# Altium schematic sheet Arduino.SchDoc: Processing interface
size A4; SheetNumber: 1; SheetTotal: 5; ENG_APP_DATE: --/--/--; DSN_APP_DATE: --/--/--; CHK_APP_DATE: --/--/--; SPICEModelCacheCJHNTGTK: <root> / <DocumentId>CJHNTGTK</DocumentId> / </root>
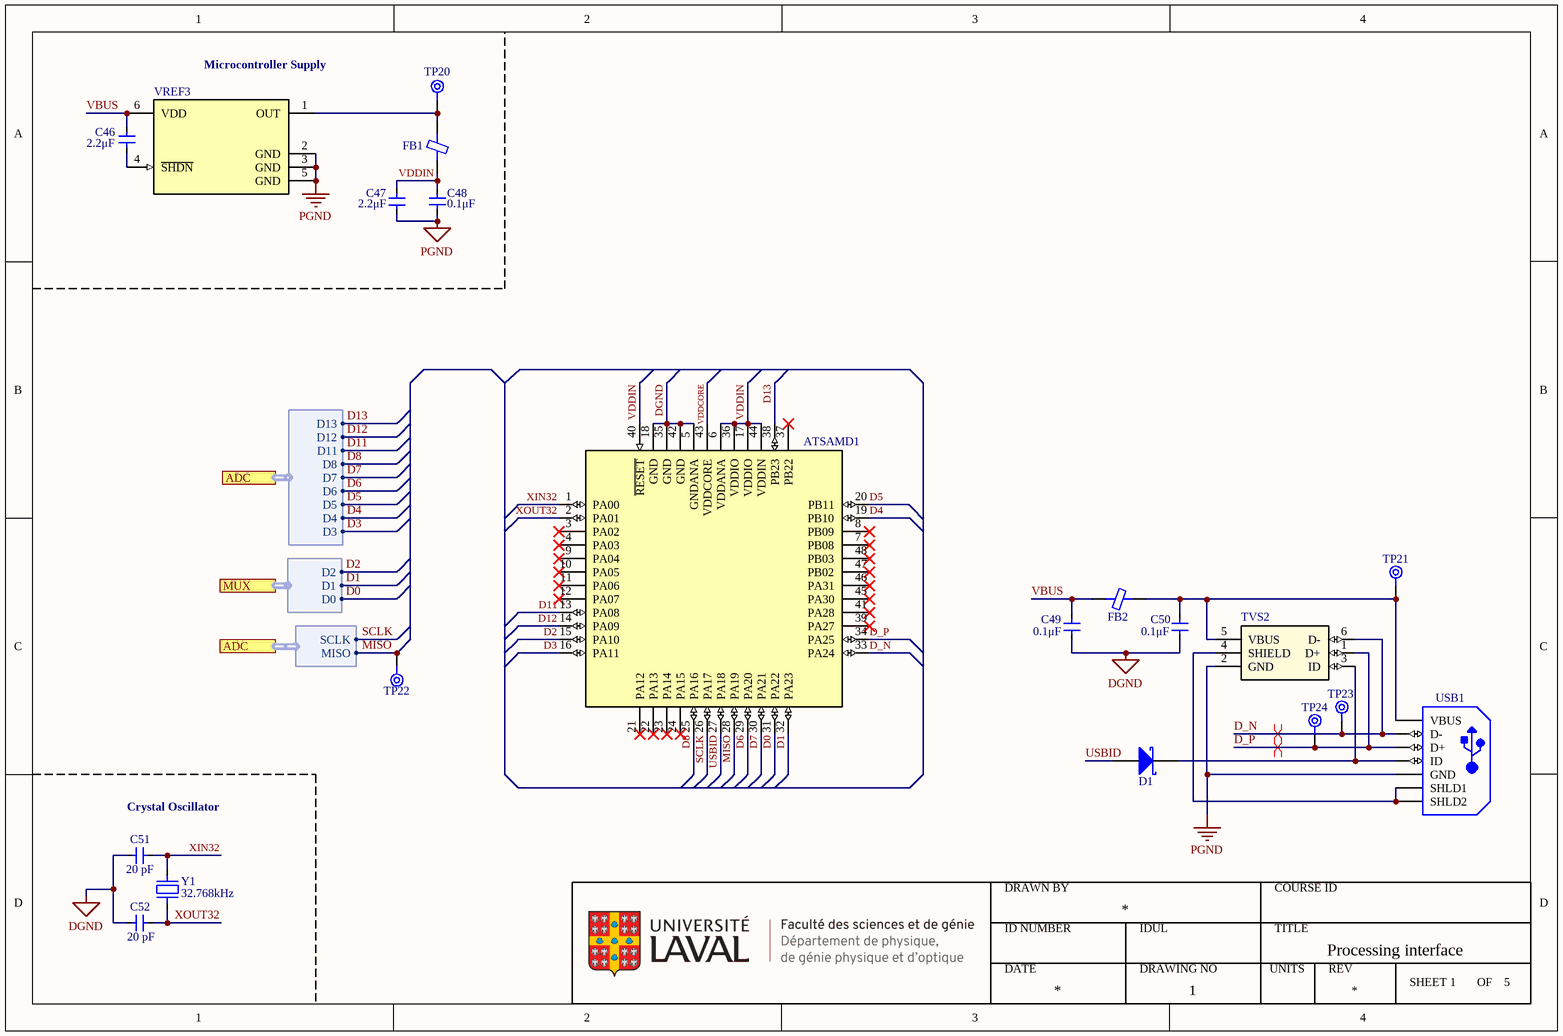
[diagram p0: Arduino.SchDoc]

## Parts
ATSAMD1  (no value)  [ATSAMD21G18-AU]
C46  value 2.2μF  [Cap Ceramic 2.2 uF 6.3V SMT 0603]  (hidden comment: Cap Ceramic 2.2 uF SMT 0603)
C47  value 2.2μF  [Cap Ceramic 2.2 uF 6.3V SMT 0603]  (hidden comment: CC0603KRX7R5BB225)
C48  Capacitance: 0.1μF  [Cap Ceramic 0.1 uF 50V SMT 0603]  (hidden comment: Cap Ceramic 0.1 uF SMT 0603)
C49  Capacitance: 0.1μF  [Cap Ceramic 0.1 uF 50V SMT 0603]  (hidden comment: Cap Ceramic 0.1 uF SMT 0603)
C50  Capacitance: 0.1μF  [Cap Ceramic 0.1 uF 50V SMT 0603]  (hidden comment: Cap Ceramic 0.1 uF SMT 0603)
C51  Capacitance: 20 pF  [Capacitor 20 pF SMT 0603]  (hidden comment: CC0603JRNPO9BN200)
C52  Capacitance: 20 pF  [Capacitor 20 pF SMT 0603]  (hidden comment: CC0603JRNPO9BN200)
D1  NSR0530HT1G  [Schottky Diode 30V SMT]  (value not drawn)
FB1  MFBM1V1608-000-R  [Eaton Ferrite Bead 0603]  (value not drawn)
FB2  MFBM1V1608-000-R  [Eaton Ferrite Bead 0603]  (value not drawn)
TP20  Test Point  [SQ Pad]  (value not drawn)  (no BOM)
TP21  Test Point  [SQ Pad]  (value not drawn)  (no BOM)
TP22  Test Point  [SQ Pad]  (value not drawn)  (no BOM)
TP23  Test Point  [SQ Pad]  (value not drawn)  (no BOM)
TP24  Test Point  [SQ Pad]  (value not drawn)  (no BOM)
TVS2  USB OTG TVS Diode Array 25V Clamp SMD  [RCLAMP0504FA.TCT]  (value not drawn)
USB1  USB3106-30-0230-A  [USB Micro-AB Connector B]  (value not drawn)
VREF3  Voltage Reference Series Fixed 3.3V  [MCP1501T-XXE/CHY]  (value not drawn)
Y1  value 32.768kHz  [ABS07-120-32.768KHZ-T A]  (hidden comment: ABS07-120-32.768KHZ-T)

## Ports
ADC (harness 2), ADC (harness 19), MUX (harness 0)

## Harnesses
2: D3, D4, D5, D6, D7, D8, D11, D12, D13
0: D2, D1, D0
19: SCLK, MISO

## Nets
DGND: ATSAMD1.5(GNDANA) ATSAMD1.18(GND) ATSAMD1.35(GND) ATSAMD1.42(GND) C49.1 C50.1 C51.1 C52.1
PGND: C47.1 C48.2 TVS2.2(GND) USB1.5(GND) VREF3.2(GND) VREF3.3(GND) VREF3.5(GND)
D0: ATSAMD1.31(PA22) ; port MUX.D0
D1: ATSAMD1.32(PA23) ; port MUX.D1
D2: ATSAMD1.15(PA10) ; port MUX.D2
D3: ATSAMD1.16(PA11) ; port ADC.D3
D4: ATSAMD1.19(PB10) ; port ADC.D4
D5: ATSAMD1.20(PB11) ; port ADC.D5
D6: ATSAMD1.29(PA20) ; port ADC.D6
D7: ATSAMD1.30(PA21) ; port ADC.D7
D8: ATSAMD1.25(PA16) ; port ADC.D8
D11: ATSAMD1.13(PA08) ; port ADC.D11
D12: ATSAMD1.14(PA09) ; port ADC.D12
D13: ATSAMD1.38(PB23) ; port ADC.D13
D_N: ATSAMD1.33(PA24) TP23.1(TP) TVS2.6(D-) USB1.2(D-)
D_P: ATSAMD1.34(PA25) TP24.1(TP) TVS2.1(D+) USB1.3(D+)
MISO: ATSAMD1.28(PA19) TP22.1(TP) ; port ADC.MISO
SCLK: ATSAMD1.26(PA17) ; port ADC.SCLK
USBID: ATSAMD1.27(PA18) D1.2
VBUS: C46.1 C49.2 FB2.2 VREF3.6(VDD)
VDDCORE: ATSAMD1.43(VDDCORE)
VDDIN: ATSAMD1.6(VDDANA) ATSAMD1.17(VDDIO) ATSAMD1.36(VDDIO) ATSAMD1.40(~{RESET}) ATSAMD1.44(VDDIN) C47.2 C48.1 FB1.1
XIN32: ATSAMD1.1(PA00) C51.2 Y1.2
XOUT32: ATSAMD1.2(PA01) C52.2 Y1.1
NetC46_2: C46.2 VREF3.4(~{SHDN})
NetC50_2: C50.2 FB2.1 TP21.1(TP) TVS2.5(VBUS) USB1.1(VBUS)
NetD1_1: D1.1 TVS2.3(ID) USB1.4(ID)
NetFB1_2: FB1.2 TP20.1(TP) VREF3.1(OUT)
NetTVS2_4: TVS2.4(SHIELD) USB1.6(SHLD1) USB1.7(SHLD2)

Not connected (* = marked no-connect by the designer): ATSAMD1 3(PA02)* 4(PA03)* 7(PB08)* 8(PB09)* 9(PA04)* 10(PA05)* 11(PA06)* 12(PA07)* 21(PA12)* 22(PA13)* 23(PA14)* 24(PA15)* 37(PB22)* 39(PA27)* 41(PA28)* 45(PA30)* 46(PA31)* 47(PB02)* 48(PB03)*

## Layout directives
differential pair: D_N, D_P

## Notes on the sheet
- (near VREF3) Microcontroller Supply
- Crystal Oscillator
- DRAWN BY
- COURSE ID
- ID NUMBER
- DATE
- IDUL
- DRAWING NO
- TITLE
- UNITS
- REV
- SHEET
- OF

## Library data of the parts
ATSAMD1 = ATSAMD21G18A-AU: ARM® Cortex®-M0+ SAM D21G, Functional Safety (FuSa) Microcontroller IC 32-Bit Single-Core 48MHz 256KB (256K x 8) FLASH 48-TQFP (7x7); Supplier 1: Digi-Key; Supplier Part Number 1: ATSAMD21G18A-AU-ND; ComponentLink1Description: Datasheet; ComponentLink1URL: https://ww1.microchip.com/downloads/en/DeviceDoc/SAM-D21-DA1-Family-Data-Sheet-DS40001882H.pdf; ComponentLink2Description: Arduino Zero; ComponentLink2URL: https://docs.arduino.cc/hardware/zero
C46 = Cap Ceramic 2.2 uF SMT 0603: 2.2 µF ±10% 6.3V Ceramic Capacitor X7R 0603 (1608 Metric); Part Number: CC0603KRX7R5BB225; manufacturer: Yageo; Applications: General Purpose; ComponentLink1Description: Datasheet; ComponentLink1URL: *; componentlink2description: DigiKey Link; componentlink2url: https://www.digikey.com/en/products/detail/yageo/CC0603KRX7R5BB225/5195203; Device Package: 0603 (1608 Metric); lastupdated: 2023-03-06 20:08:32; Lifecycle Status: Active; Minimum Order: 1; Mounting Type: Surface Mount, MLCC; Operating Temperature: -55°C ~ 125°C; Package / Case: 0603 (1608 Metric); packaging: TapeAndReel; partid: 41539; Part Status: Active; price: 0.01; series: CC; Size / Dimension: 0.063" L x 0.031" W (1.60mm x 0.80mm); Temperature Coefficient: X7R; Thickness (Max): 0.035" (0.90mm); Tolerance: ±10%; Voltage - Rated: 6.3V; Supplier 1: Digi-Key; Supplier Part Number 1: 311-1795-1-ND; Supplier 2: Digi-Key; Supplier Part Number 2: 311-1795-6-ND; Supplier 3: Digi-Key; Supplier Part Number 3: 311-1795-2-ND
C47 = Cap Ceramic 2.2 uF SMT 0603: 2.2 µF ±10% 6.3V Ceramic Capacitor X7R 0603 (1608 Metric); manufacturer: Yageo; Part Number: CC0603KRX7R5BB225; Applications: General Purpose; ComponentLink1Description: Datasheet; ComponentLink1URL: *; componentlink2description: DigiKey Link; componentlink2url: https://www.digikey.com/en/products/detail/yageo/CC0603KRX7R5BB225/5195203; Device Package: 0603 (1608 Metric); lastupdated: 2023-03-06 20:08:32; Lifecycle Status: Active; Minimum Order: 1; Mounting Type: Surface Mount, MLCC; Operating Temperature: -55°C ~ 125°C; Package / Case: 0603 (1608 Metric); packaging: TapeAndReel; partid: 41539; Part Status: Active; price: 0.01; series: CC; Size / Dimension: 0.063" L x 0.031" W (1.60mm x 0.80mm); Temperature Coefficient: X7R; Thickness (Max): 0.035" (0.90mm); Tolerance: ±10%; Voltage - Rated: 6.3V; Supplier 1: Digi-Key; Supplier Part Number 1: 311-1795-1-ND; Supplier 2: Digi-Key; Supplier Part Number 2: 311-1795-6-ND; Supplier 3: Digi-Key; Supplier Part Number 3: 311-1795-2-ND
C48-C50 = Cap Ceramic 0.1 uF SMT 0603: 0.1 µF ±5% 50V Ceramic Capacitor X7R 0603 (1608 Metric); Part Number: CC0603JRX7R9BB104; manufacturer: Yageo; Applications: General Purpose; componentlink1description: Datasheet; componentlink1url: https://www.yageo.com/upload/media/product/productsearch/datasheet/mlcc/UPY-GPHC_X7R_6.3V-to-50V_18.pdf; componentlink2description: DigiKey Link; componentlink2url: https://www.digikey.com/en/products/detail/yageo/CC0603JRX7R9BB104/5195188; Device Package: 0603 (1608 Metric); lastupdated: 2023-03-06 20:08:09; Lifecycle Status: Active; Minimum Order: 1; Mounting Type: Surface Mount, MLCC; Operating Temperature: -55°C ~ 125°C; Package / Case: 0603 (1608 Metric); packaging: TapeAndReel; partid: 12474; Part Status: Active; price: 0.01; series: CC; Size / Dimension: 0.063" L x 0.031" W (1.60mm x 0.80mm); Temperature Coefficient: X7R; Thickness (Max): 0.035" (0.90mm); Tolerance: ±5%; Voltage - Rated: 50V; Supplier 1: Digi-Key; Supplier Part Number 1: 311-1779-1-ND; Supplier 2: Digi-Key; Supplier Part Number 2: 311-1779-6-ND; Supplier 3: Digi-Key; Supplier Part Number 3: 311-1779-2-ND
C51 C52 = Cap Ceramic 20 pF SMT 0603: 20 pF ±5% 50V Ceramic Capacitor C0G, NP0 0603 (1608 Metric); manufacturer: Yageo; Part Number: CC0603JRNPO9BN200; Applications: General Purpose; componentlink1description: Datasheet; componentlink1url: https://www.yageo.com/upload/media/product/productsearch/datasheet/mlcc/UPY-GP_NP0_16V-to-50V_17.pdf; componentlink2description: DigiKey Link; componentlink2url: https://www.digikey.com/en/products/detail/yageo/CC0603JRNPO9BN200/2833589; Device Package: 0603 (1608 Metric); lastupdated: 2023-03-06 20:07:50; Lifecycle Status: Active; Minimum Order: 1; Mounting Type: Surface Mount, MLCC; Operating Temperature: -55°C ~ 125°C; Package / Case: 0603 (1608 Metric); packaging: TapeAndReel; partid: 16728; Part Status: Active; price: 0.01; series: CC; Size / Dimension: 0.063" L x 0.031" W (1.60mm x 0.80mm); Temperature Coefficient: C0G, NP0; Thickness (Max): 0.035" (0.90mm); Tolerance: ±5%; Voltage - Rated: 50V; Supplier 1: Digi-Key; Supplier Part Number 1: 311-1424-1-ND; Supplier 2: Digi-Key; Supplier Part Number 2: 311-1424-6-ND; Supplier 3: Digi-Key; Supplier Part Number 3: 311-1424-2-ND
D1 = Schottky Diode 30V: Schottky Diode 30 V 500mA Surface Mount SOD-323; Manufacturer: ON Semiconductor; Capacitance @ Vr, F: 10pF @ 1V, 1MHz; Current - Average Rectified (Io): 500mA (DC); Current - Reverse Leakage @ Vr: 200µA @ 30V; Speed: Fast Recovery =< 500ns, > 200mA (Io); Voltage - DC Reverse (Vr) (Max): 30V; Voltage - Forward (Vf) (Max) @ If: 620mV @ 500mA; Part Number: NSR0530HT1G; ComponentLink1Description: Datasheet; ComponentLink1URL: http://www.onsemi.com/pub/Collateral/NSR0530H-D.PDF; ComponentLink2Description: DigiKey Link; ComponentLink2URL: http://digikey.com/product-detail/en/on-semiconductor/NSR0530HT1G/NSR0530HT1GOSCT-ND/5761654; Diode Type: Schottky; LastUpdated: 2023-03-06 21:08:52; Lifecycle Status: Active; Minimum Order: 1; Mounting Type: Surface Mount; Operating Temperature - Junction: -55°C ~ 150°C; Package / Case: SC-76, SOD-323; Packaging: TapeAndReel; PartId: 3077; Part Status: Active; Price: 0.03; Series: -; Supplier Device Package: SOD-323; Supplier 1: Digi-Key; Supplier Part Number 1: NSR0530HT1GOSCT-ND; Supplier 2: Digi-Key; Supplier Part Number 2: NSR0530HT1GOSDKR-ND; Supplier 3: Digi-Key; Supplier Part Number 3: NSR0530HT1GOSTR-ND
FB1 FB2 = Ferrite Bead 0R SMD 0603: 0Ω 1 Power Line Ferrite Bead 0603 (1608 Metric) 6A 20mOhm; Manufacturer: Eaton - Electronics Division; Impedance @ Frequency: 0 Ohms @ 100 MHz; Number of Lines: 1; Value: 0 Ohms @ 100 MHz; Part Number: MFBM1V1608-000-R; ComponentLink1Description: Datasheet; ComponentLink1URL: https://www.eaton.com/content/dam/eaton/products/electronic-components/resources/data-sheet/eaton-mfbm1v1608-high-current-multilayer-ferrite-chip-bead-data-sheet.pdf; ComponentLink2Description: DigiKey Link; ComponentLink2URL: https://www.digikey.com/en/products/detail/eaton-electronics-division/MFBM1V1608-000-R/13161356; Current Rating (Max): 6A; DC Resistance (DCR) (Max): 20mOhm; Device Package: 0603 (1608 Metric); Filter Type: Power Line; Height (Max): 0.039" (1.00mm); LastUpdated: 2023-03-12 7:51:35 PM; Lifecycle Status: Active; Minimum Order: 1; Mounting Type: Surface Mount; Operating Temperature: -40°C ~ 85°C; Package / Case: 0603 (1608 Metric); Packaging: TapeAndReel; PartId: 2605; Part Status: Active; Price: 0.01; Series: MFBM1V1608; Size / Dimension: 0.063" L x 0.031" W (1.60mm x 0.80mm); Supplier 1: Digi-Key; Supplier Part Number 1: 283-MFBM1V1608-000-RCT-ND; Supplier 2: Digi-Key; Supplier Part Number 2: 283-MFBM1V1608-000-RDKR-ND
TVS2 = USB OTG TVS Diode Array 25V Clamp SMD: 25V Clamp 6A (8/20µs) Ipp Tvs Diode Surface Mount SC-70-6; Supplier 1: Digi-Key; Supplier Part Number 1: RCLAMP0504FATCTCT-ND; Supplier 2: Digi-Key; Supplier Part Number 2: RCLAMP0504FATCTDKR-ND; Supplier 3: Digi-Key; Supplier Part Number 3: RCLAMP0504FATCTTR-ND
USB1 = USB Micro-AB Connector A: USB - Micro AB 2.0 Receptacle Connector 5 Position, Vertical, Through Hole with 2.30 mm (Standard) Shell Stakes, 5-Pin THD, RoHS, Tape and Reel; Supplier 1: Newark; Supplier Part Number 1: 18X0232
VREF3 = Voltage Reference Series Fixed 3.3V: Series Voltage Reference IC Fixed 3.3V V ±0.1% 20 mA SOT-23-6; Temperature Coefficient: 50ppm/°C; Output Current: 20mA; Tolerance: 0.08%; Operating Supply Current: 550μA; ComponentLink1Description: Datasheet; ComponentLink1URL: https://ww1.microchip.com/downloads/aemDocuments/documents/MSLD/ProductDocuments/DataSheets/MCP1501-Data-Sheet-DS20005474F.pdf; Reference Type: Series; Case/Package: SOT-23-6; Output Type: Fixed; Min Output Voltage: 3.3V; Min Operating Temperature: -40°C; Max Operating Temperature: 125°C; Supplier 1: Digi-Key; Supplier Part Number 1: MCP1501T-33E/CHYCT-ND; Supplier 2: Digi-Key; Supplier Part Number 2: MCP1501T-33E/CHYDKR-ND; Supplier 3: Digi-Key; Supplier Part Number 3: MCP1501T-33E/CHYTR-ND
Y1 = Crystal Abracon ABS07: 32.768 kHz ±20ppm Crystal 6pF 55 kOhms 2-SMD, No Lead; Manufacturer: Abracon LLC; Operating Mode: Fundamental; Part Number: ABS07-120-32.768KHZ-T; ComponentLink1Description: Datasheet; ComponentLink1URL: https://abracon.com/Resonators/ABS07-120-32.768kHz-T.pdf; ComponentLink2Description: DigiKey Link; ComponentLink2URL: https://www.digikey.com/en/products/detail/abracon-llc/ABS07-120-32-768KHZ-T/3724043; ESR (Equivalent Series Resistance): 55 kOhms; Frequency Tolerance: ±20ppm; Height - Seated (Max): 0.035" (0.90mm); LastUpdated: 2023-03-06 20:57:22; Lifecycle Status: Active; Load Capacitance: 6pF; Minimum Order: 1; Mounting Type: Surface Mount; Operating Temperature: -40°C ~ 85°C; Package / Case: 2-SMD, No Lead; Packaging: TapeAndReel; PartId: 385; Part Status: Active; Price: 0.44; Series: ABS07; Size / Dimension: 0.126" L x 0.059" W (3.20mm x 1.50mm); Type: kHz Crystal (Tuning Fork); Supplier 1: Digi-Key; Supplier Part Number 1: 535-11937-1-ND; Supplier 2: Digi-Key; Supplier Part Number 2: 535-11937-6-ND; Supplier 3: Digi-Key; Supplier Part Number 3: 535-11937-2-ND; Frequency: 32.768 kHz